# EAGLE schematic But (EAGLE 7.2.0)
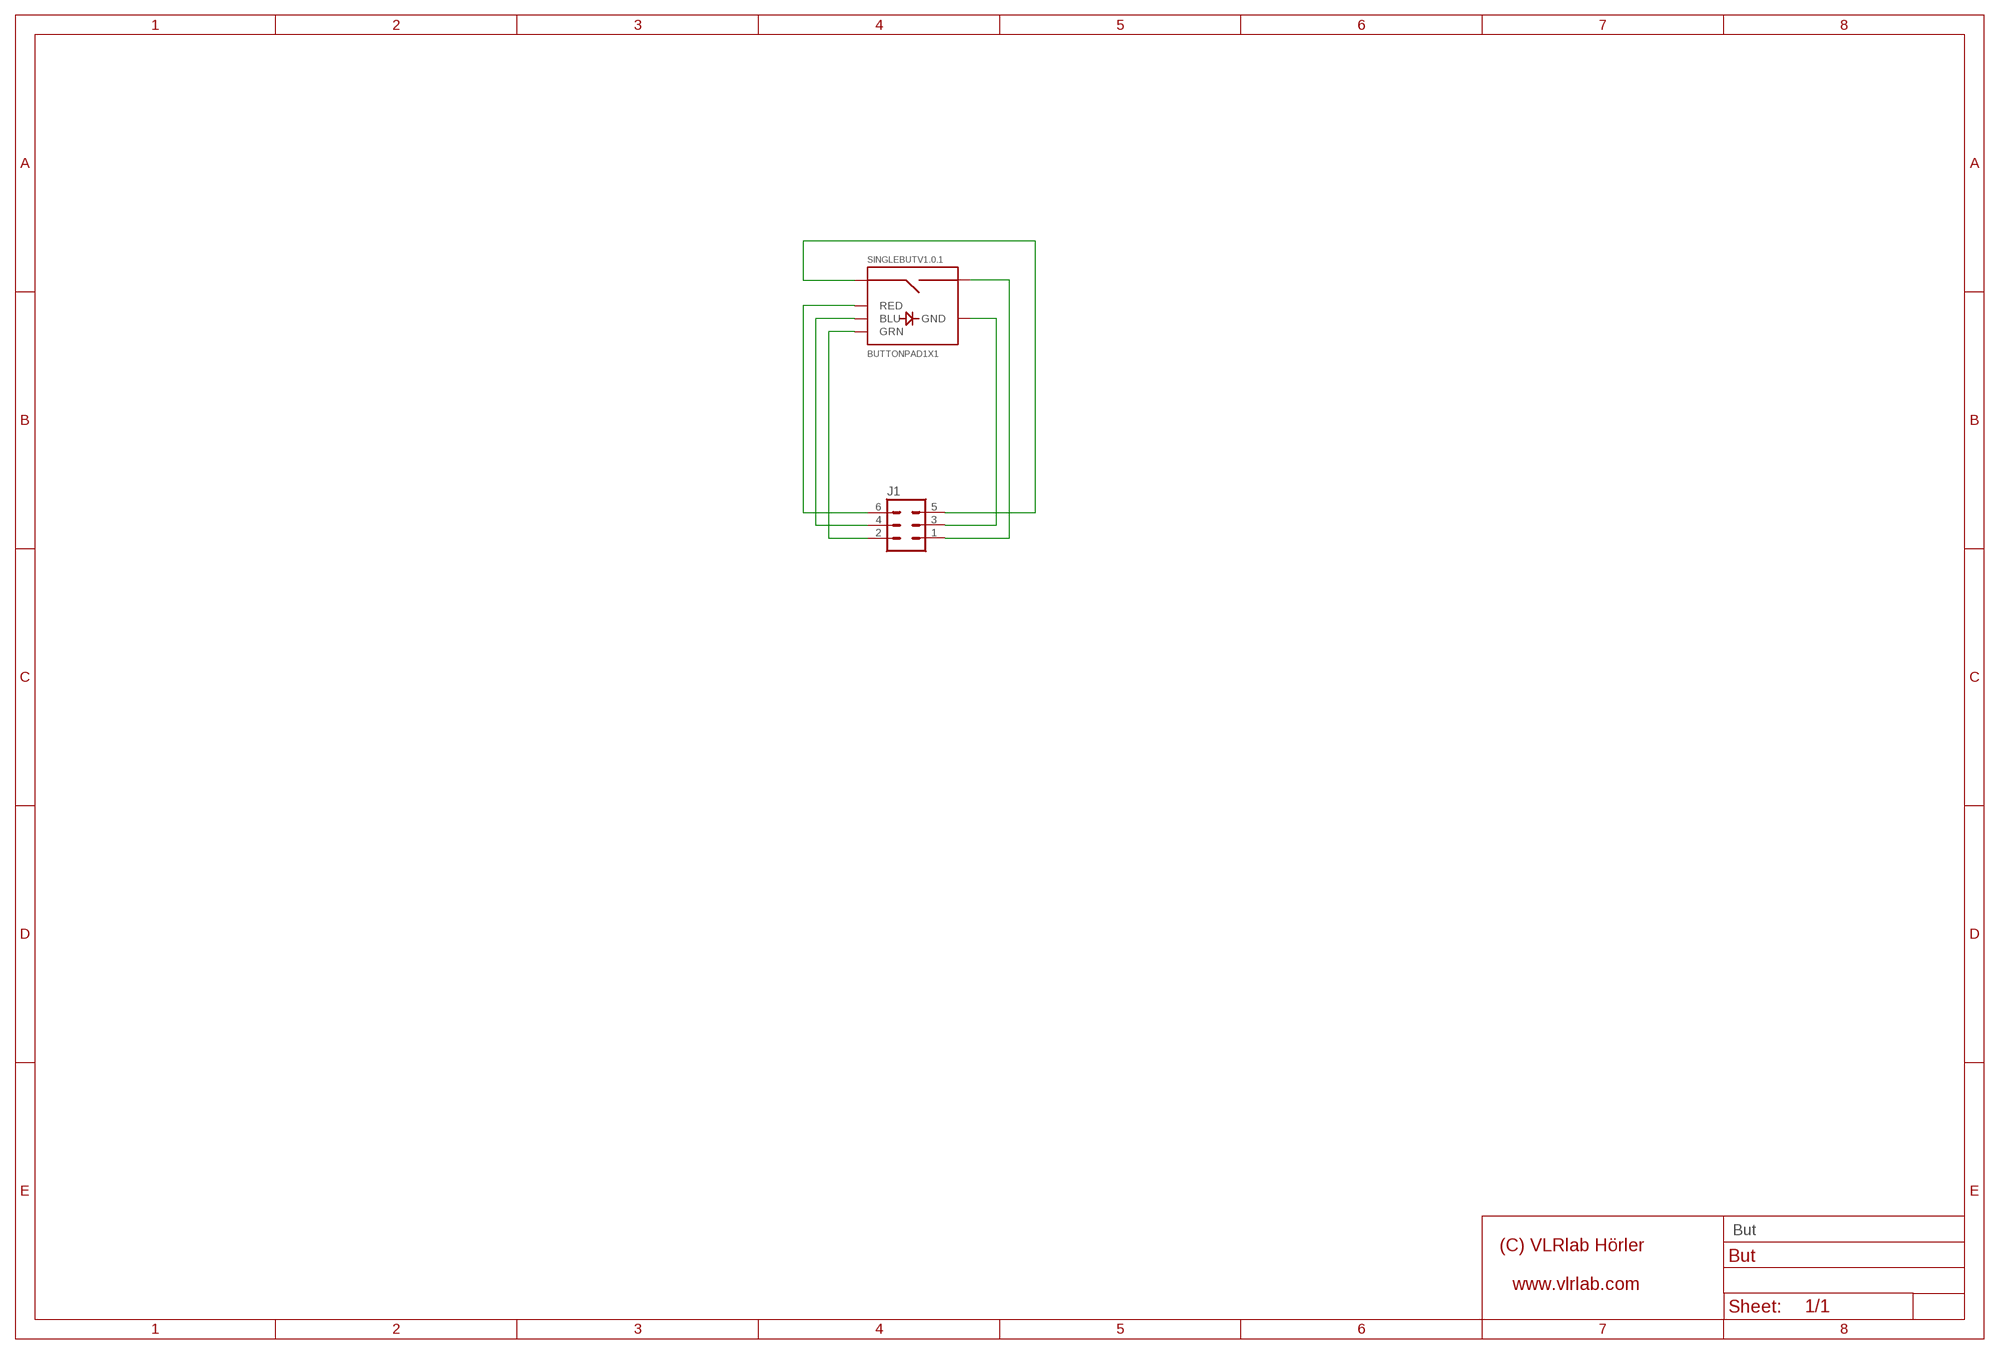
[diagram p0: schematic, sheet 1]

## Parts
J1  ML6  [ML6]
SINGLEBUTV1.0.1  BUTTONPAD1X1  [BUTTONPAD1X1]

## Nets
N$1: J1.5 SINGLEBUTV1.0.1.SIG01(SIG1)
N$2: J1.6 SINGLEBUTV1.0.1.RED1(RED)
N$3: J1.4 SINGLEBUTV1.0.1.BLU1(BLU)
N$4: J1.2 SINGLEBUTV1.0.1.GRN1(GRN)
N$5: J1.3 SINGLEBUTV1.0.1.GND1(GND)
N$6: J1.1 SINGLEBUTV1.0.1.SIG02(SIG2)

## Notes on the sheet
- But

## Library data of the parts
J1 = con-ml_Ivan:ML6: HARTING; OC_FARNELL: unknown; OC_NEWARK: unknown
SINGLEBUTV1.0.1 = Rubberbutton:BUTTONPAD1X1

## Net classes
0 default: clearance 0.205 mm